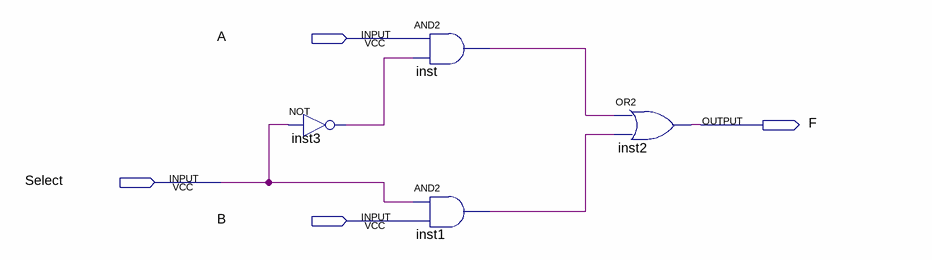
[diagram p0: schematic sheet]
// Quartus schematic 2x1mux.bdf as structural Verilog: 4 symbols, 4 pins
module \2x1mux  (
  input  A,
  input  Select,
  input  B,
  output F
);

  wire inst1_out, inst3_out, inst_out;

  not inst3 (inst3_out, Select);
  and inst (inst_out, A, inst3_out);
  and inst1 (inst1_out, Select, B);
  or inst2 (F, inst_out, inst1_out);
endmodule
